# EAGLE design HAB-3 rev1 (EAGLE 7.5.0)
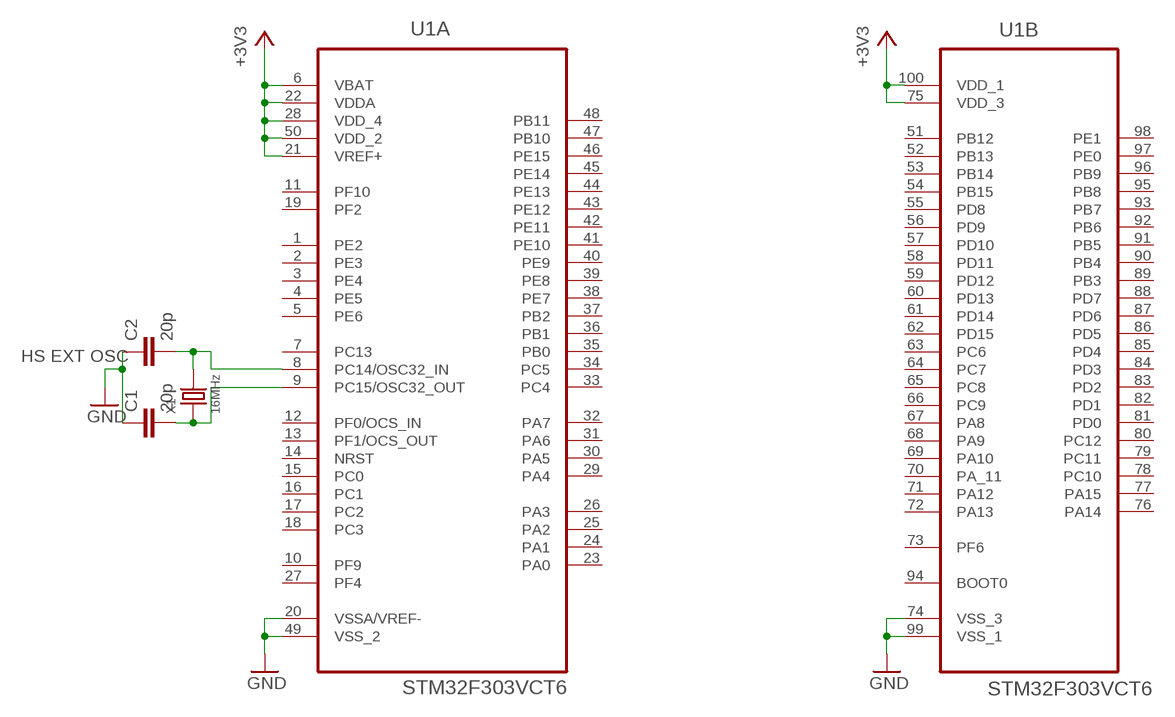
[diagram p0: schematic, sheet 1]

## Parts
C1  20p  C-EUC0603  [C0603]
C2  20p  C-EUC0603  [C0603]
U1  STM32F303VCT6  [QFP50P1600X1600X160-100N]
X1  16MHz  CRYSTAL'3225'  [X4-SMD-3.2X2.5X0.7MM]

## Nets
+3V3: U1.6(A:VBAT) U1.21(A:VREF+) U1.22(A:VDDA) U1.28(A:VDD_4) U1.50(A:VDD_2) U1.75(B:VDD_3) U1.100(B:VDD_1)
GND: C1.1 C2.1 U1.20(A:VSSA/VREF-) U1.49(A:VSS_2) U1.74(B:VSS_3) U1.99(B:VSS_1)
N$1: C2.2 U1.8(A:PC14/OSC32_IN) X1.3
N$2: C1.2 U1.9(A:PC15/OSC32_OUT) X1.1
Unconnected: U1.1(A:PE2) U1.2(A:PE3) U1.3(A:PE4) U1.4(A:PE5) U1.5(A:PE6) U1.7(A:PC13) U1.10(A:PF9) U1.11(A:PF10) U1.12(A:PF0/OCS_IN) U1.13(A:PF1/OCS_OUT) U1.14(A:NRST) U1.15(A:PC0) U1.16(A:PC1) U1.17(A:PC2) U1.18(A:PC3) U1.23(A:PA0) U1.24(A:PA1) U1.25(A:PA2) U1.26(A:PA3) U1.27(A:PF4) U1.29(A:PA4) U1.30(A:PA5) U1.31(A:PA6) U1.32(A:PA7) U1.33(A:PC4) U1.34(A:PC5) U1.35(A:PB0) U1.36(A:PB1) U1.37(A:PB2) U1.38(A:PE7) U1.39(A:PE8) U1.40(A:PE9) U1.41(A:PE10) U1.42(A:PE11) U1.43(A:PE12) U1.44(A:PE13) U1.45(A:PE14) U1.46(A:PE15) U1.47(A:PB10) U1.48(A:PB11) U1.51(B:PB12) U1.52(B:PB13) U1.53(B:PB14) U1.54(B:PB15) U1.55(B:PD8) U1.56(B:PD9) U1.57(B:PD10) U1.58(B:PD11) U1.59(B:PD12) U1.60(B:PD13) U1.61(B:PD14) U1.62(B:PD15) U1.63(B:PC6) U1.64(B:PC7) U1.65(B:PC8) U1.66(B:PC9) U1.67(B:PA8) U1.68(B:PA9) U1.69(B:PA10) U1.70(B:PA_11) U1.71(B:PA12) U1.72(B:PA13) U1.73(B:PF6) U1.76(B:PA14) U1.77(B:PA15) U1.78(B:PC10) U1.79(B:PC11) U1.80(B:PC12) U1.81(B:PD0) U1.82(B:PD1) U1.83(B:PD2) U1.84(B:PD3) U1.85(B:PD4) U1.86(B:PD5) U1.87(B:PD6) U1.88(B:PD7) U1.89(B:PB3) U1.90(B:PB4) U1.91(B:PB5) U1.92(B:PB6) U1.93(B:PB7) U1.94(B:BOOT0) U1.95(B:PB8) U1.96(B:PB9) U1.97(B:PE0) U1.98(B:PE1)

## Notes on the sheet
- HS EXT OSC

## Power pins joined to a net without a drawn wire
PF2: U1.19(A:PF2)

## Library data of the parts
C1 C2 = rcl:C-EU: CAPACITOR, European symbol
U1 = ears-hab3:STM32F303VCT6: MCU, 32BIT, CORTEX M4, 100LQFP; MPN: STM32F303VCT6; OC_FARNELL: 2215110; OC_NEWARK: 46W2194; PACKAGE: 100LQFP; SUPPLIER: STMicroelectronics
X1 = Seeed-OPL-Crystal-Oscillator:CRYSTAL

## Board
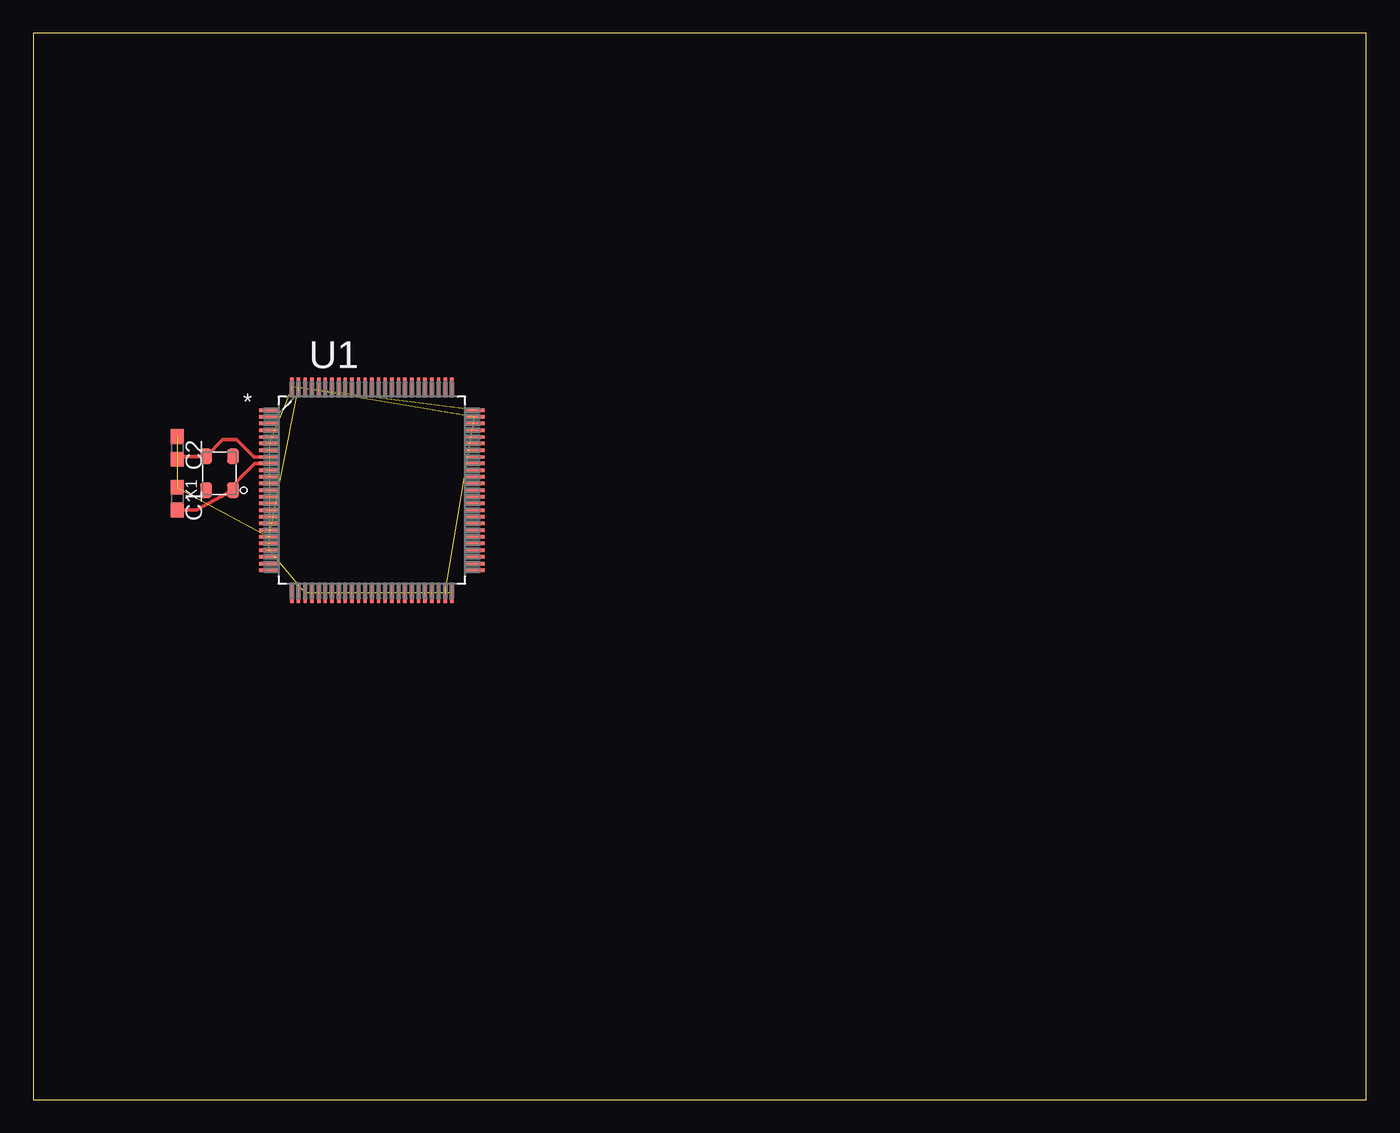
[diagram p1: board, top side]

Size 100 x 80 mm. Coordinates in mm from the lower left corner, seen from the top.
Outline: 0,0 100,0 100,80 0,80 0,0
Copper layers (1*16): Top 0.035mm / dielectric 1.5mm / Bottom 0.035mm
Design rules "default": minimum track width 10mil, minimum drill 24mil, track to track 8mil, track to pad 8mil, pad to pad 8mil, via to via 8mil, smd to smd 8mil, copper to edge 40mil, drill to drill 8mil, minimum pad ring 10mil, minimum via ring 8mil, stop-mask expansion 4mil, vias tented up to drill 0mil, thermal gap 10mil

### Footprints (pad centres in the part's own frame; a part is rotated, then mirrored left to right if it is on the bottom)
C0603 = smd 1.1 x 1: 1 -0.85,0; 2 0.85,0
QFP50P1600X1600X160-100N = smd 1.473 x 0.254: 1 -7.722,5.994; 2 -7.722,5.512; 3 -7.722,5.004; 4 -7.722,4.496; 5 -7.722,3.988; 6 -7.722,3.505; 7 -7.722,2.997; 8 -7.722,2.489; 9 -7.722,2.007; 10 -7.722,1.499; 11 -7.722,0.991; 12 -7.722,0.508; 13 -7.722,0; 14 -7.722,-0.508; 15 -7.722,-0.991; 16 -7.722,-1.499; 17 -7.722,-2.007; 18 -7.722,-2.489; 19 -7.722,-2.997; 20 -7.722,-3.505; 21 -7.722,-3.988; 22 -7.722,-4.496; 23 -7.722,-5.004; 24 -7.722,-5.512; 25 -7.722,-5.994; 51 7.722,-5.994; 52 7.722,-5.512; 53 7.722,-5.004; 54 7.722,-4.496; 55 7.722,-3.988; 56 7.722,-3.505; 57 7.722,-2.997; 58 7.722,-2.489; 59 7.722,-2.007; 60 7.722,-1.499; 61 7.722,-0.991; 62 7.722,-0.508; 63 7.722,0; 64 7.722,0.508; 65 7.722,0.991; 66 7.722,1.499; 67 7.722,2.007; 68 7.722,2.489; 69 7.722,2.997; 70 7.722,3.505; 71 7.722,3.988; 72 7.722,4.496; 73 7.722,5.004; 74 7.722,5.512; 75 7.722,5.994 | smd 0.254 x 1.473: 26 -5.994,-7.722; 27 -5.512,-7.722; 28 -5.004,-7.722; 29 -4.496,-7.722; 30 -3.988,-7.722; 31 -3.505,-7.722; 32 -2.997,-7.722; 33 -2.489,-7.722; 34 -2.007,-7.722; 35 -1.499,-7.722; 36 -0.991,-7.722; 37 -0.508,-7.722; 38 0,-7.722; 39 0.508,-7.722; 40 0.991,-7.722; 41 1.499,-7.722; 42 2.007,-7.722; 43 2.489,-7.722; 44 2.997,-7.722; 45 3.505,-7.722; 46 3.988,-7.722; 47 4.496,-7.722; 48 5.004,-7.722; 49 5.512,-7.722; 50 5.994,-7.722; 76 5.994,7.722; 77 5.512,7.722; 78 5.004,7.722; 79 4.496,7.722; 80 3.988,7.722; 81 3.505,7.722; 82 2.997,7.722; 83 2.489,7.722; 84 2.007,7.722; 85 1.499,7.722; 86 0.991,7.722; 87 0.508,7.722; 88 0,7.722; 89 -0.508,7.722; 90 -0.991,7.722; 91 -1.499,7.722; 92 -2.007,7.722; 93 -2.489,7.722; 94 -2.997,7.722; 95 -3.505,7.722; 96 -3.988,7.722; 97 -4.496,7.722; 98 -5.004,7.722; 99 -5.512,7.722; 100 -5.994,7.722
X4-SMD-3.2X2.5X0.7MM = smd 1.143 x 0.889: 1 -1.27,-1.016; 2 1.27,-1.016; 3 1.27,1.016; 4 -1.27,1.016

### Placement (x,y rotation side)
C1  10.79,45.09 270 top
C2  10.79,48.9 270 top
U1  25.4,45.72 0 top
X1  13.97,46.99 90 top

### Tracks (layer width: path | path; a pad name or v marks a point on that pad's centre or on a via)
+3V3  (6 unrouted)
GND  (5 unrouted)
N$1
  Top 0.254: U1.8 16.56,48.21 15.24,49.53 14.22,49.53 X1.3 11.01,48.26 C2.2
N$2
  Top 0.254: C1.2 12.23,44.23 X1.1 15.24,45.97 15.24,46.35 16.61,47.73 U1.9